# Altium schematic sheet biolab_rev2.SchDoc
size A; SheetNumber: 1; SheetTotal: 1
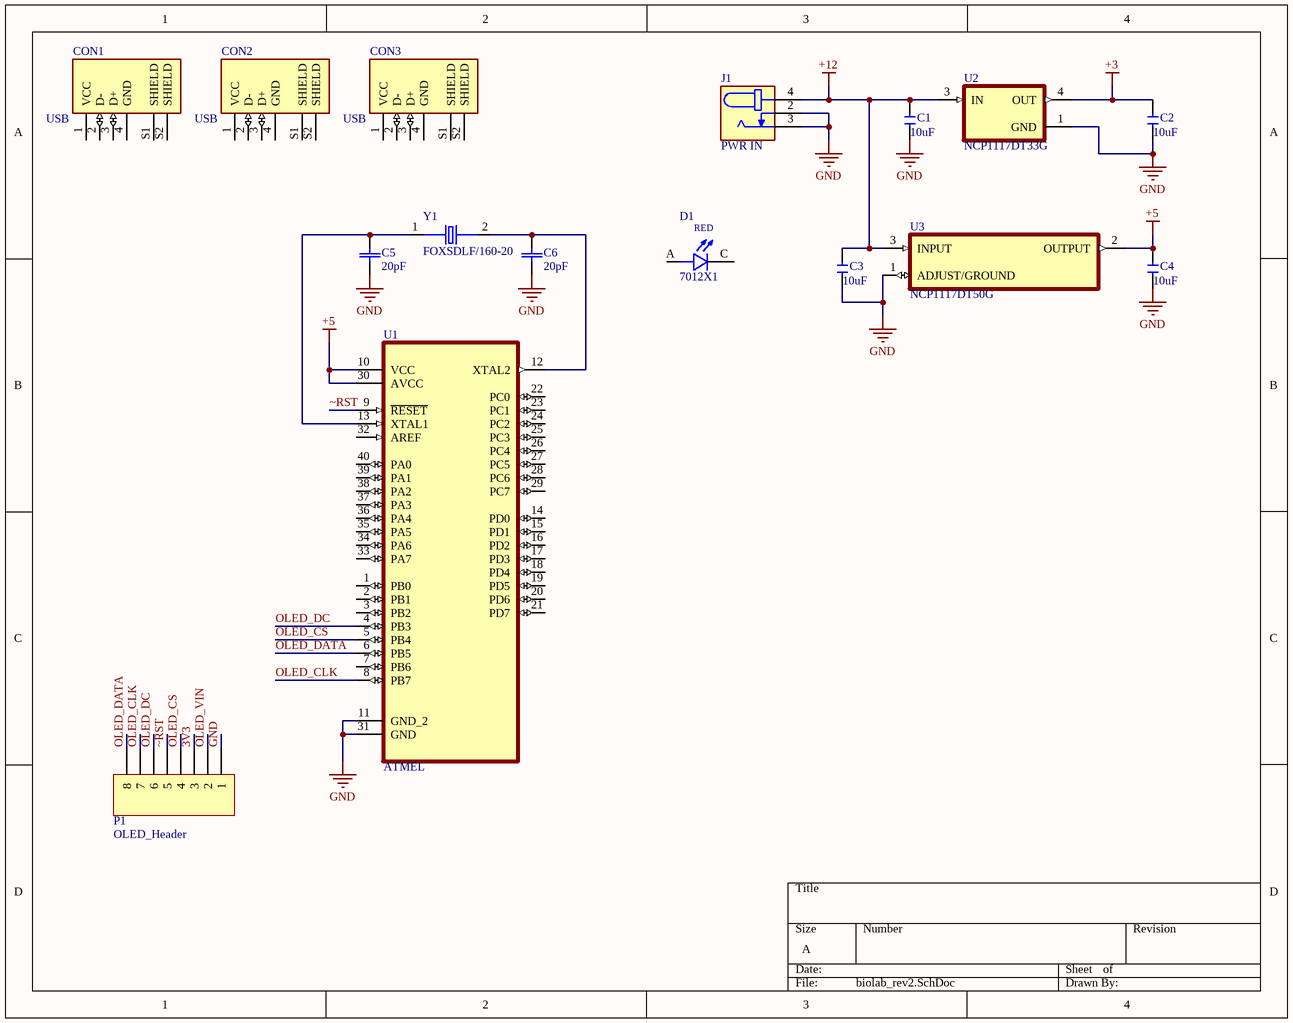
[diagram p0: biolab_rev2.SchDoc]

## Parts
C1  10uF  [C0603]
C2  10uF  [C0603]
C3  10uF  [C0603]
C4  10uF  [C0603]
C5  20pF  [CAPC1608X85N]
C6  20pF  [CAPC1608X85N]
CON1  USB  [GCT_USB1130-15-A_REVA]
CON2  USB  [GCT_USB1130-15-A_REVA]
CON3  USB  [GCT_USB1130-15-A_REVA]
D1  7012X1  [LED_7012X1]
J1  PWR IN  [NINIGI_DC-005]
P1  OLED_Header  [HDR1X8]
U1  ATMEL  [DIP254P1524X483-40]
U2  NCP1117DT33G  [VREG_NCP1117DT33G]
U3  NCP1117DT50G  [DPAK229P990X238-4N]
Y1  FOXSDLF/160-20  [XTAL_FOXSDLF/160-20]

## Nets
+3: C2.2 U2.4(OUT)
+5: C4.2 U1.10(VCC) U1.30(AVCC) U3.2(OUTPUT)
+12: C1.2 C3.2 J1.4 U2.3(IN) U3.3(INPUT)
GND: C1.1 C2.1 C3.1 C4.1 C5.1(C1) C6.1(C1) J1.2 J1.3 P1.1 U1.11(GND_2) U1.31(GND) U2.1(GND) U3.1(ADJUST/GROUND)
3V3: P1.3
OLED_CLK: P1.7 U1.8(PB7)
OLED_CS: P1.4 U1.5(PB4)
OLED_DATA: P1.8 U1.6(PB5)
OLED_DC: P1.6 U1.4(PB3)
OLED_VIN: P1.2
~RST: P1.5 U1.9(~{RESET})
NetC5_2: C5.2(C2) U1.13(XTAL1) Y1.1
NetC6_2: C6.2(C2) U1.12(XTAL2) Y1.2

Not connected (* = marked no-connect by the designer): CON1 1(VCC) 2(D-) 3(D+) 4(GND) S1(SHIELD) S2(SHIELD); CON2 1(VCC) 2(D-) 3(D+) 4(GND) S1(SHIELD) S2(SHIELD); CON3 1(VCC) 2(D-) 3(D+) 4(GND) S1(SHIELD) S2(SHIELD); D1 A C; U1 1(PB0) 2(PB1) 3(PB2) 7(PB6) 14(PD0) 15(PD1) 16(PD2) 17(PD3) 18(PD4) 19(PD5) 20(PD6) 21(PD7) 22(PC0) 23(PC1) 24(PC2) 25(PC3) 26(PC4) 27(PC5) 28(PC6) 29(PC7) 32(AREF) 33(PA7) 34(PA6) 35(PA5) 36(PA4) 37(PA3) 38(PA2) 39(PA1) 40(PA0)

## Notes on the sheet
- (in symbol 7012X1) RED

## Library data of the parts
C1-C4 = CERAMIC-10UF-10V-10%-X5R(0603): 302010103; MF: {'manufacturer': u'Yageo'}; Price: None; Value: *; MP: CERAMIC-10UF-10V-10%-X5R(0603); Package: None; Availability: Unavailable
C5 C6 = C0603C200J5GACTU: CAPACITOR, 0603; MF: {'manufacturer': u'KEMET'}; Price: None; Value: *; Package: None; MP: C0603C200J5GACTU; Availability: Unavailable
CON1-CON3 = USB1130-15-A_REVA: MF: {'manufacturer': u'Global Connector Technology'}; MP: USB1130-15-A_REVA; Value: *; Price: None; Package: None; Availability: Unavailable
D1 = 7012X1: Red LED Indication - Discrete 1.7V 0805 (2012 Metric); MF: {'manufacturer': u'Visual'}; Availability: Unavailable; Value: *; Package: None; MP: 7012X1; Price: None
J1 = DC-005: DC Jack; MF: {'manufacturer': u'Best Inc.'}; Package: None; Availability: Unavailable; Price: None; MP: DC-005; Value: *
P1 = Header 8: Header, 8-Pin; LatestRevisionDate: 17-Jul-2002; LatestRevisionNote: Re-released for DXP Platform.; Publisher: Altium Limited
U1 = ATMEGA644PV-10PU: 8-bit Microcontroller with In-System Programmable  Flash; MF: {'manufacturer': u'Microchip Technology'}; Availability: Unavailable; MP: ATMEGA644PV-10PU; Value: *; Price: None; Package: None
U2 = NCP1117DT33G: 1.0 A Positive LDO Linear Voltage Regulator (Fixed and Adjustable) Vout: 3.3 V; MF: {'manufacturer': u'ON Semiconductor'}; Price: None; Value: *; MP: NCP1117DT33G; Package: None; Availability: Unavailable
U3 = NCP1117DT50G: MF: {'manufacturer': u'ON Semiconductor'}; Price: None; Value: *; Package: None; MP: NCP1117DT50G; Availability: Unavailable
Y1 = FOXSDLF/160-20: Crystal 16MHz 20pF 2-Pin HC-49/SD; MF: {'manufacturer': u'Fox Electronics'}; Value: *; Availability: Unavailable; Package: None; MP: FOXSDLF/160-20; Price: None